# Altium schematic sheet AVR_KBD.SchDoc
size A4
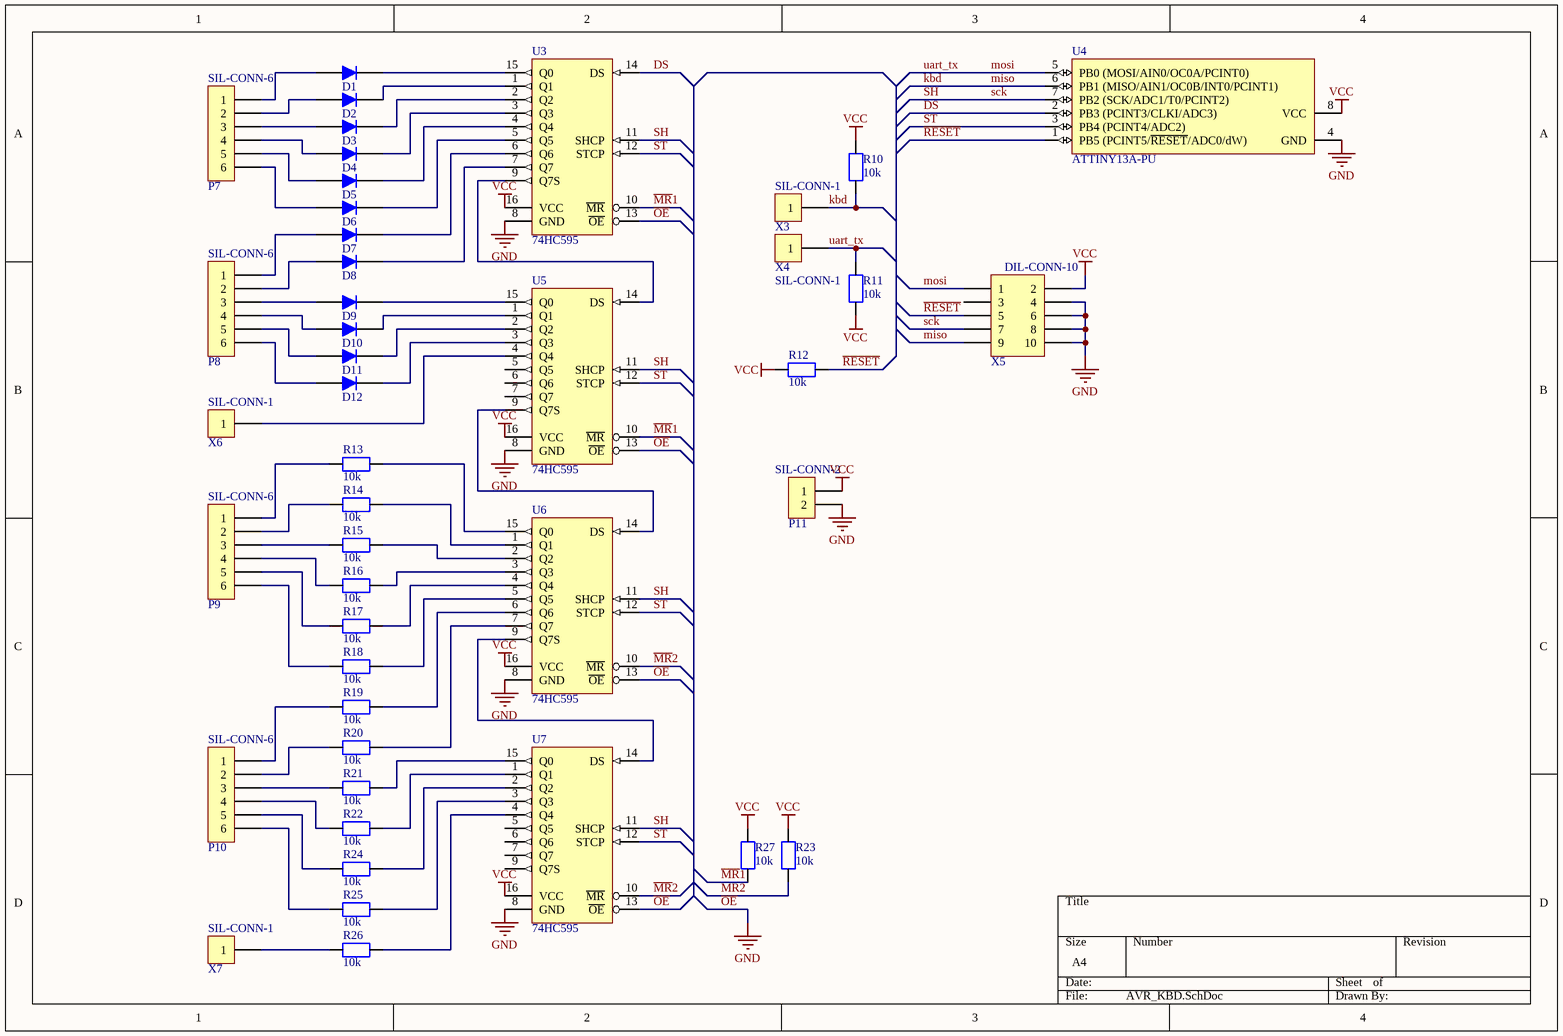
[diagram p0: AVR_KBD.SchDoc]

## Parts
D1  Diode  [DO35]  (value not drawn)
D2  Diode  [DO35]  (value not drawn)
D3  Diode  [DO35]  (value not drawn)
D4  Diode  [DO35]  (value not drawn)
D5  Diode  [DO35]  (value not drawn)
D6  Diode  [DO35]  (value not drawn)
D7  Diode  [DO35]  (value not drawn)
D8  Diode  [DO35]  (value not drawn)
D9  Diode  [DO35]  (value not drawn)
D10  Diode  [DO35]  (value not drawn)
D11  Diode  [DO35]  (value not drawn)
D12  Diode  [DO35]  (value not drawn)
P7  SIL-CONN-6  [SIL-CONN-6]
P8  SIL-CONN-6  [SIL-CONN-6]
P9  SIL-CONN-6  [SIL-CONN-6]
P10  SIL-CONN-6  [SIL-CONN-6]
P11  SIL-CONN-2  [SIL-CONN-2]
R10  value 10k  [0805_Resistor]  (hidden comment: Resistor)
R11  value 10k  [0805_Resistor]  (hidden comment: Resistor)
R12  value 10k  [0805_Resistor]  (hidden comment: Resistor)
R13  value 10k  [0805_Resistor]  (hidden comment: Resistor)
R14  value 10k  [0805_Resistor]  (hidden comment: Resistor)
R15  value 10k  [0805_Resistor]  (hidden comment: Resistor)
R16  value 10k  [0805_Resistor]  (hidden comment: Resistor)
R17  value 10k  [0805_Resistor]  (hidden comment: Resistor)
R18  value 10k  [0805_Resistor]  (hidden comment: Resistor)
R19  value 10k  [0805_Resistor]  (hidden comment: Resistor)
R20  value 10k  [0805_Resistor]  (hidden comment: Resistor)
R21  value 10k  [0805_Resistor]  (hidden comment: Resistor)
R22  value 10k  [0805_Resistor]  (hidden comment: Resistor)
R23  value 10k  [0805_Resistor]  (hidden comment: Resistor)
R24  value 10k  [0805_Resistor]  (hidden comment: Resistor)
R25  value 10k  [0805_Resistor]  (hidden comment: Resistor)
R26  value 10k  [0805_Resistor]  (hidden comment: Resistor)
R27  value 10k  [0805_Resistor]  (hidden comment: Resistor)
U3  74HC595  [SOIC16]
U4  ATTINY13A-PU  [DIP8]
U5  74HC595  [SOIC16]
U6  74HC595  [SOIC16]
U7  74HC595  [SOIC16]
X3  SIL-CONN-1  [SIL-CONN-1]
X4  SIL-CONN-1  [SIL-CONN-1]
X5  DIL-CONN-10  [DIL-CONN-IDC-10]
X6  SIL-CONN-1  [SIL-CONN-1]
X7  SIL-CONN-1  [SIL-CONN-1]

## Nets
~{OE}: P11.2 U3.8(GND) U3.13(~{OE}) U4.4(GND) U5.8(GND) U5.13(~{OE}) U6.8(GND) U6.13(~{OE}) U7.8(GND) U7.13(~{OE}) X5.4 X5.6 X5.8 X5.10  [also labelled GND]
VCC: P11.1 R10.2 R11.1 R12.2 R23.2 R27.2 U3.16(VCC) U4.8(VCC) U5.16(VCC) U6.16(VCC) U7.16(VCC) X5.2
DS: U3.14(DS) U4.2(PB3_(PCINT3/CLKI/ADC3))
kbd: R10.1 U4.6(PB1_(MISO/AIN1/OC0B/INT0/PCINT1)) X3.1 X5.9  [also labelled miso]
~{MR}1: R27.1 U3.10(~{MR}) U5.10(~{MR})
~{MR}2: R23.1 U6.10(~{MR}) U7.10(~{MR})
mosi: R11.2 U4.5(PB0_(MOSI/AIN0/OC0A/PCINT0)) X4.1 X5.1  [also labelled uart_tx]
~{RESET}: R12.1 U4.1(PB5_(PCINT5/~{RESET}/ADC0/dW)) X5.5
sck: U3.11(SHCP) U4.7(PB2_(SCK/ADC1/T0/PCINT2)) U5.11(SHCP) U6.11(SHCP) U7.11(SHCP) X5.7  [also labelled SH]
ST: U3.12(STCP) U4.3(PB4_(PCINT4/ADC2)) U5.12(STCP) U6.12(STCP) U7.12(STCP)
NetD1_A: D1.A P7.1
NetD1_K: D1.K U3.15(Q0)
NetD2_A: D2.A P7.2
NetD2_K: D2.K U3.1(Q1)
NetD3_A: D3.A P7.3
NetD3_K: D3.K U3.2(Q2)
NetD4_A: D4.A P7.4
NetD4_K: D4.K U3.3(Q3)
NetD5_A: D5.A P7.5
NetD5_K: D5.K U3.4(Q4)
NetD6_A: D6.A P7.6
NetD6_K: D6.K U3.5(Q5)
NetD7_A: D7.A P8.1
NetD7_K: D7.K U3.6(Q6)
NetD8_A: D8.A P8.2
NetD8_K: D8.K U3.7(Q7)
NetD9_A: D9.A P8.3
NetD9_K: D9.K U5.15(Q0)
NetD10_A: D10.A P8.4
NetD10_K: D10.K U5.1(Q1)
NetD11_A: D11.A P8.5
NetD11_K: D11.K U5.2(Q2)
NetD12_A: D12.A P8.6
NetD12_K: D12.K U5.3(Q3)
NetP9_1: P9.1 R13.1
NetP9_2: P9.2 R14.1
NetP9_3: P9.3 R15.1
NetP9_4: P9.4 R16.1
NetP9_5: P9.5 R17.1
NetP9_6: P9.6 R18.1
NetP10_1: P10.1 R19.1
NetP10_2: P10.2 R20.1
NetP10_3: P10.3 R21.1
NetP10_4: P10.4 R22.1
NetP10_5: P10.5 R24.1
NetP10_6: P10.6 R25.1
NetR13_2: R13.2 U6.15(Q0)
NetR14_2: R14.2 U6.1(Q1)
NetR15_2: R15.2 U6.2(Q2)
NetR16_2: R16.2 U6.3(Q3)
NetR17_2: R17.2 U6.4(Q4)
NetR18_2: R18.2 U6.5(Q5)
NetR19_2: R19.2 U6.6(Q6)
NetR20_2: R20.2 U6.7(Q7)
NetR21_2: R21.2 U7.15(Q0)
NetR22_2: R22.2 U7.1(Q1)
NetR24_2: R24.2 U7.2(Q2)
NetR25_2: R25.2 U7.3(Q3)
NetR26_1: R26.1 X7.1
NetR26_2: R26.2 U7.4(Q4)
NetU3_9: U3.9(Q7S) U5.14(DS)
NetU5_4: U5.4(Q4) X6.1
NetU5_9: U5.9(Q7S) U6.14(DS)
NetU6_9: U6.9(Q7S) U7.14(DS)

Not connected (* = marked no-connect by the designer): U5 5(Q5) 6(Q6) 7(Q7); U7 5(Q5) 6(Q6) 7(Q7) 9(Q7S); X5 3